# Altium project 7seg.PrjPcb
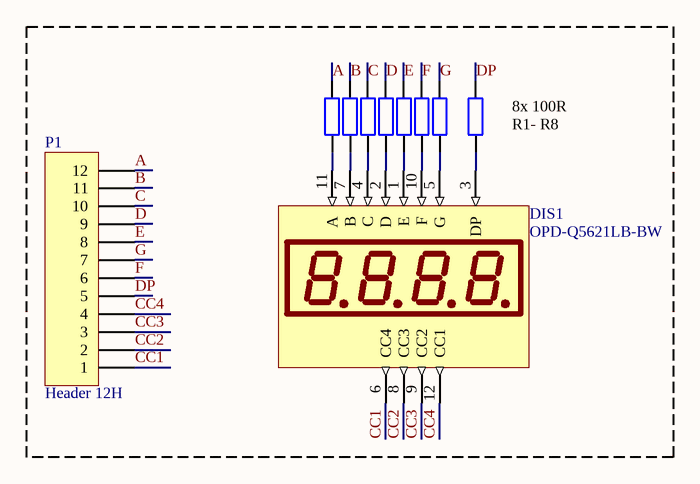
[diagram p0: 7seg.SchDoc]
1 sheet, 10 parts. Net scope: global (net labels, ports and power ports of the same name join across sheets).
Board file: 7seg.PcbDoc

## Sheet 7seg.SchDoc
size A4

### Parts
DIS1  OPD-Q5621LB-BW  [OPD-Q5621LB-BW]
P1  Header 12H  [MA12-1L]
R1  100R  [R0805]  (value not drawn)
R2  100R  [R0805]  (value not drawn)
R3  100R  [R0805]  (value not drawn)
R4  100R  [R0805]  (value not drawn)
R5  100R  [R0805]  (value not drawn)
R6  100R  [R0805]  (value not drawn)
R7  100R  [R0805]  (value not drawn)
R8  100R  [R0805]  (value not drawn)

### Nets
A: P1.12 R1.2
B: P1.11 R2.2
C: P1.10 R3.2
CC1: DIS1.6(CC4) P1.1
CC2: DIS1.8(CC3) P1.2
CC3: DIS1.9(CC2) P1.3
CC4: DIS1.12(CC1) P1.4
D: P1.9 R4.2
DP: P1.5 R8.2
E: P1.8 R5.2
F: P1.6 R6.2
G: P1.7 R7.2
NetDIS1_1: DIS1.1(E) R5.1
NetDIS1_2: DIS1.2(D) R4.1
NetDIS1_3: DIS1.3(DP) R8.1
NetDIS1_4: DIS1.4(C) R3.1
NetDIS1_5: DIS1.5(G) R7.1
NetDIS1_7: DIS1.7(B) R2.1
NetDIS1_10: DIS1.10(F) R6.1
NetDIS1_11: DIS1.11(A) R1.1

### Notes on the sheet
- (near R8) 8x 100R
- (near R8) R1- R8

### Library data of the parts
DIS1 = OPD-Q5621LB-BW: Wyświetlacz: LED; 7-segmentowy; 14,2mm; niebieski; 80mcd; katoda
P1 = Header 12H: Header, 12-Pin, Right Angle
R1-R8 = Res: Resistor